# EAGLE schematic SI7051 (EAGLE 9.6.2)
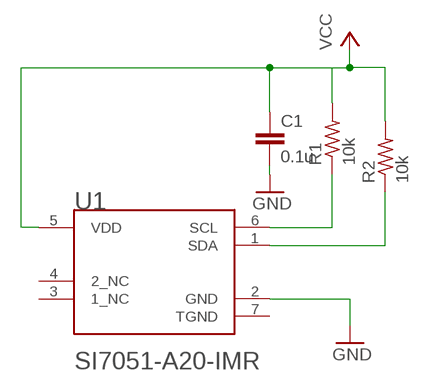
[diagram p0: schematic, sheet 1]

## Parts
C1  0.1u  C-EUC0603  [C0603]
R1  10k  R-US_R0603  [R0603]
R2  10k  R-US_R0603  [R0603]
U1  SILICON_LABS_SI7051-A20-IMRSILICON_LABS_SI7051-A20-IMR_0_3  [SILICON_LABS_SI7051-A20-IMR_3]

## Nets
GND: C1.2 U1.2(GND)
N$3: R1.1 U1.6(SCL)
N$4: R2.1 U1.1(SDA)
VCC: C1.1 R1.2 R2.2 U1.5(VDD)
Unconnected: U1.3(1_NC) U1.4(2_NC)

## Power pins joined to a net without a drawn wire
TGND: U1.7(TGND)

## Library data of the parts
C1 = rcl:C-EU: CAPACITOR, European symbol; SPICEPREFIX: C
R1 R2 = rcl:R-US_: RESISTOR, American symbol; SPICEPREFIX: R
U1 = Silicon Labs - SI7051-A20-IMR:SILICON_LABS_SI7051-A20-IMR: Temperature Sensor Digital, Local -40°C ~ 125°C 14 b 6-DFN (3x3); AMBIENT_TEMPERATURE_RANGE_HIGH: +125°C; AMBIENT_TEMPERATURE_RANGE_LOW: -40°C; AUTOMOTIVE: No; CENTROID_NOT_SPECIFIED: No; DATASHEET: https://www.silabs.com/documents/public/data-sheets/Si7050-1-3-4-5-A20.pdf; DEVICE_CLASS_L1: Sensors; DEVICE_CLASS_L2: Temperature and Humidity Sensors; DEVICE_CLASS_L3: unset; DIGIKEY_DESCRIPTION: SENSOR DIGITAL -40C-125C 6DFN; DIGIKEY_PART_NUMBER: 336-4764-1-ND; FOOTPRINT_PARAMETERS_1: {"fp_type":"DFN","params":{"N":{"nom":6,"long name":"Number of leads","min":null,"max":null,"short name":"N","type":"count"},"A":{"nom":750000,"long name":"Height","min":700000,"max":800000,"short name":"A","type":"measurement"},"A1":{"nom":20000,"long name":"Package clearance","min":0,"max":50000,"short name":"A1","type":"measurement"},"A2":{"nom":730000,"long name":"Package height","min":650000,"max":800000,"short name":"A2","type":"measurement"},"D":{"nom":3000000,"long name":"Package length","min":2900000,"max":3100000,"short name":"D","type":"measurement"},"E":{"nom":3000000,"long name":"Package width","min":2900000,"max":3100000,"short name":"E","type":"measurement"},"B":{"nom":400000,"long name":"Lead width","min":350000,"max":450000,"short name":"B","type":"measurement"},"C":{"nom":100000,"long name":"Lead thickness","min":null,"max":null,"short name":"C","type":"measurement"},"L":{"nom":400000,"long name":"Lead foot length","min":350000,"max":450000,"short name":"L","type":"measurement"},"e":{"nom":1000000,"long name":"Lead pitch","min":null,"max":null,"short name":"e","type":"measurement"},"HT":{"default":"Yes","long name":"Thermal pad","type":"multichoiceparent","short name":"HT","children":["D2","E2","PC"]},"offset x":{"nom":0,"long name":"X Center offset","min":null,"max":null,"short name":"offset x","type":"measurement"},"offset y":{"nom":0,"long name":"Y Center offset","min":null,"max":null,"short name":"offset y","type":"measurement"},"LS":{"default":"Rounded rectangle","long name":"Land shape","type":"multichoice","short name":"LS"},"LS1":{"default":"Rectangle","long name":"Land shape (Pin 1)","type":"multichoice","short name":"LS1"},"solder toe":{"nom":400000,"long name":"Solder fillet (toe)","min":null,"max":null,"short name":"solder toe","type":"fixedmeasurement"},"solder heel":{"nom":0,"long name":"Solder fillet (heel)","min":null,"max":null,"short name":"solder heel","type":"fixedmeasurement"},"solder side":{"nom":-40000,"long name":"Solder fillet (side)","min":null,"max":null,"short name":"solder side","type":"fixedmeasurement"},"courtyard":{"nom":500000,"long name":"Courtyard","min":null,"max":null,"short name":"courtyard","type":"fixedmeasurement"},"SF":{"default":"A","long name":"Packing level","type":"multichoiceparent","short name":"SF","help":"http://support.upverter.com/customer/portal/articles/978783-what-is-a-footprint-packing-level","children":["solder toe","solder heel","solder side","courtyard"]},"D2":{"nom":2400000,"long name":"Thermal pad length","min":2300000,"max":2500000,"short name":"D2","type":"measurement"},"E2":{"nom":1500000,"long name":"Thermal pad width","min":1400000,"max":1600000,"short name":"E2","type":"measurement"},"PC":{"long name":"Paste coverage (%)","type":"percentage","short name":"PC","value":40}}}; FOOTPRINT_PARAMETERS_2: {"fp_type":"DFN","params":{"N":{"nom":6,"long name":"Number of leads","min":null,"max":null,"short name":"N","type":"count"},"A":{"nom":750000,"long name":"Height","min":700000,"max":800000,"short name":"A","type":"measurement"},"A1":{"nom":20000,"long name":"Package clearance","min":0,"max":50000,"short name":"A1","type":"measurement"},"A2":{"nom":730000,"long name":"Package height","min":650000,"max":800000,"short name":"A2","type":"measurement"},"D":{"nom":3000000,"long name":"Package length","min":2900000,"max":3100000,"short name":"D","type":"measurement"},"E":{"nom":3000000,"long name":"Package width","min":2900000,"max":3100000,"short name":"E","type":"measurement"},"B":{"nom":400000,"long name":"Lead width","min":350000,"max":450000,"short name":"B","type":"measurement"},"C":{"nom":100000,"long name":"Lead thickness","min":null,"max":null,"short name":"C","type":"measurement"},"L":{"nom":400000,"long name":"Lead foot length","min":350000,"max":450000,"short name":"L","type":"measurement"},"e":{"nom":1000000,"long name":"Lead pitch","min":null,"max":null,"short name":"e","type":"measurement"},"D2":{"nom":2400000,"long name":"Thermal pad length","min":2300000,"max":2500000,"short name":"D2","type":"measurement"},"E2":{"nom":1500000,"long name":"Thermal pad width","min":1400000,"max":1600000,"short name":"E2","type":"measurement"},"PC":{"long name":"Paste coverage (%)","type":"percentage","short name":"PC","value":40},"HT":{"default":"Yes","long name":"Thermal pad","type":"multichoiceparent","short name":"HT","children":["D2","E2","PC"]},"offset x":{"nom":0,"long name":"X Center offset","min":null,"max":null,"short name":"offset x","type":"measurement"},"offset y":{"nom":0,"long name":"Y Center offset","min":null,"max":null,"short name":"offset y","type":"measurement"},"LS":{"default":"Rounded rectangle","long name":"Land shape","type":"multichoice","short name":"LS"},"LS1":{"default":"Rectangle","long name":"Land shape (Pin 1)","type":"multichoice","short name":"LS1"},"solder toe":{"nom":300000,"long name":"Solder fillet (toe)","min":null,"max":null,"short name":"solder toe","type":"fixedmeasurement"},"solder heel":{"nom":0,"long name":"Solder fillet (heel)","min":null,"max":null,"short name":"solder heel","type":"fixedmeasurement"},"solder side":{"nom":-40000,"long name":"Solder fillet (side)","min":null,"max":null,"short name":"solder side","type":"fixedmeasurement"},"courtyard":{"nom":250000,"long name":"Courtyard","min":null,"max":null,"short name":"courtyard","type":"fixedmeasurement"},"SF":{"default":"B","long name":"Packing level","type":"multichoiceparent","short name":"SF","help":"http://support.upverter.com/customer/portal/articles/978783-what-is-a-footprint-packing-level","children":["solder toe","solder heel","solder side","courtyard"]}}}; FOOTPRINT_PARAMETERS_3: {"fp_type":"DFN","params":{"N":{"nom":6,"long name":"Number of leads","min":null,"max":null,"short name":"N","type":"count"},"A":{"nom":750000,"long name":"Height","min":700000,"max":800000,"short name":"A","type":"measurement"},"A1":{"nom":20000,"long name":"Package clearance","min":0,"max":50000,"short name":"A1","type":"measurement"},"A2":{"nom":730000,"long name":"Package height","min":650000,"max":800000,"short name":"A2","type":"measurement"},"D":{"nom":3000000,"long name":"Package length","min":2900000,"max":3100000,"short name":"D","type":"measurement"},"E":{"nom":3000000,"long name":"Package width","min":2900000,"max":3100000,"short name":"E","type":"measurement"},"B":{"nom":400000,"long name":"Lead width","min":350000,"max":450000,"short name":"B","type":"measurement"},"C":{"nom":100000,"long name":"Lead thickness","min":null,"max":null,"short name":"C","type":"measurement"},"L":{"nom":400000,"long name":"Lead foot length","min":350000,"max":450000,"short name":"L","type":"measurement"},"e":{"nom":1000000,"long name":"Lead pitch","min":null,"max":null,"short name":"e","type":"measurement"},"D2":{"nom":2400000,"long name":"Thermal pad length","min":2300000,"max":2500000,"short name":"D2","type":"measurement"},"E2":{"nom":1500000,"long name":"Thermal pad width","min":1400000,"max":1600000,"short name":"E2","type":"measurement"},"PC":{"long name":"Paste coverage (%)","type":"percentage","short name":"PC","value":40},"HT":{"default":"Yes","long name":"Thermal pad","type":"multichoiceparent","short name":"HT","children":["D2","E2","PC"]},"offset x":{"nom":0,"long name":"X Center offset","min":null,"max":null,"short name":"offset x","type":"measurement"},"offset y":{"nom":0,"long name":"Y Center offset","min":null,"max":null,"short name":"offset y","type":"measurement"},"LS":{"default":"Rounded rectangle","long name":"Land shape","type":"multichoice","short name":"LS"},"LS1":{"default":"Rectangle","long name":"Land shape (Pin 1)","type":"multichoice","short name":"LS1"},"solder toe":{"nom":200000,"long name":"Solder fillet (toe)","min":null,"max":null,"short name":"solder toe","type":"fixedmeasurement"},"solder heel":{"nom":0,"long name":"Solder fillet (heel)","min":null,"max":null,"short name":"solder heel","type":"fixedmeasurement"},"solder side":{"nom":-40000,"long name":"Solder fillet (side)","min":null,"max":null,"short name":"solder side","type":"fixedmeasurement"},"courtyard":{"nom":100000,"long name":"Courtyard","min":null,"max":null,"short name":"courtyard","type":"fixedmeasurement"},"SF":{"default":"C","long name":"Packing level","type":"multichoiceparent","short name":"SF","help":"http://support.upverter.com/customer/portal/articles/978783-what-is-a-footprint-packing-level","children":["solder toe","solder heel","solder side","courtyard"]}}}; FOOTPRINT_VARIANT_NAME_0: Recommended_Land_Pattern; FOOTPRINT_VARIANT_NAME_1: IPC_A; FOOTPRINT_VARIANT_NAME_2: IPC_B; FOOTPRINT_VARIANT_NAME_3: IPC_C; HEIGHT: 0.8mm; INTERFACE: I2C; IPC_LAND_PATTERN_NAME: DFN300X300X75-6; LEAD_FREE: Unknown; MAX_SUPPLY_VOLTAGE: 3.6V; MF: Silicon Labs; MFG_PACKAGE_IDENT: 0; MFG_PACKAGE_IDENT_DATE: 0; MFG_PACKAGE_IDENT_REV: 0; MIN_SUPPLY_VOLTAGE: 1.9V; MOUSER_DESCRIPTION: Temp Sensor Digital Serial (I2C) 6-Pin DFN EP T/R; MOUSER_PART_NUMBER: 634-SI7051-A20-IMR; MPN: SI7051-A20-IMR; OPERATING_SUPPLY_CURRENT: 90uA; PACKAGE: DFN6; PIN_0_0_1_INSIDE_EDGE: clock; PREFIX: U; RESOLUTION: 14bits; ROHS: Unknown; SENSOR_OUTPUT: I2C; STANDOFF_HEIGHT: 0mm; TEMPERATURE_RANGE_HIGH: +125°C; TEMPERATURE_RANGE_LOW: -40°C; VERIFICATION_VERSION: 0.0.0.3